# EasyEDA Pro project Complete_project.epro, schematic Schematic3

## Sheets
1 主控: Board Name: core2.0; Create Date: 2025-02-19; Page Name: 主控; Project Name: 煮茶机; Schematic Name: Schematic3; Update Date: 2025-03-25; Company: 嘉立创EDA; Page Size: A4; Version: V1.0
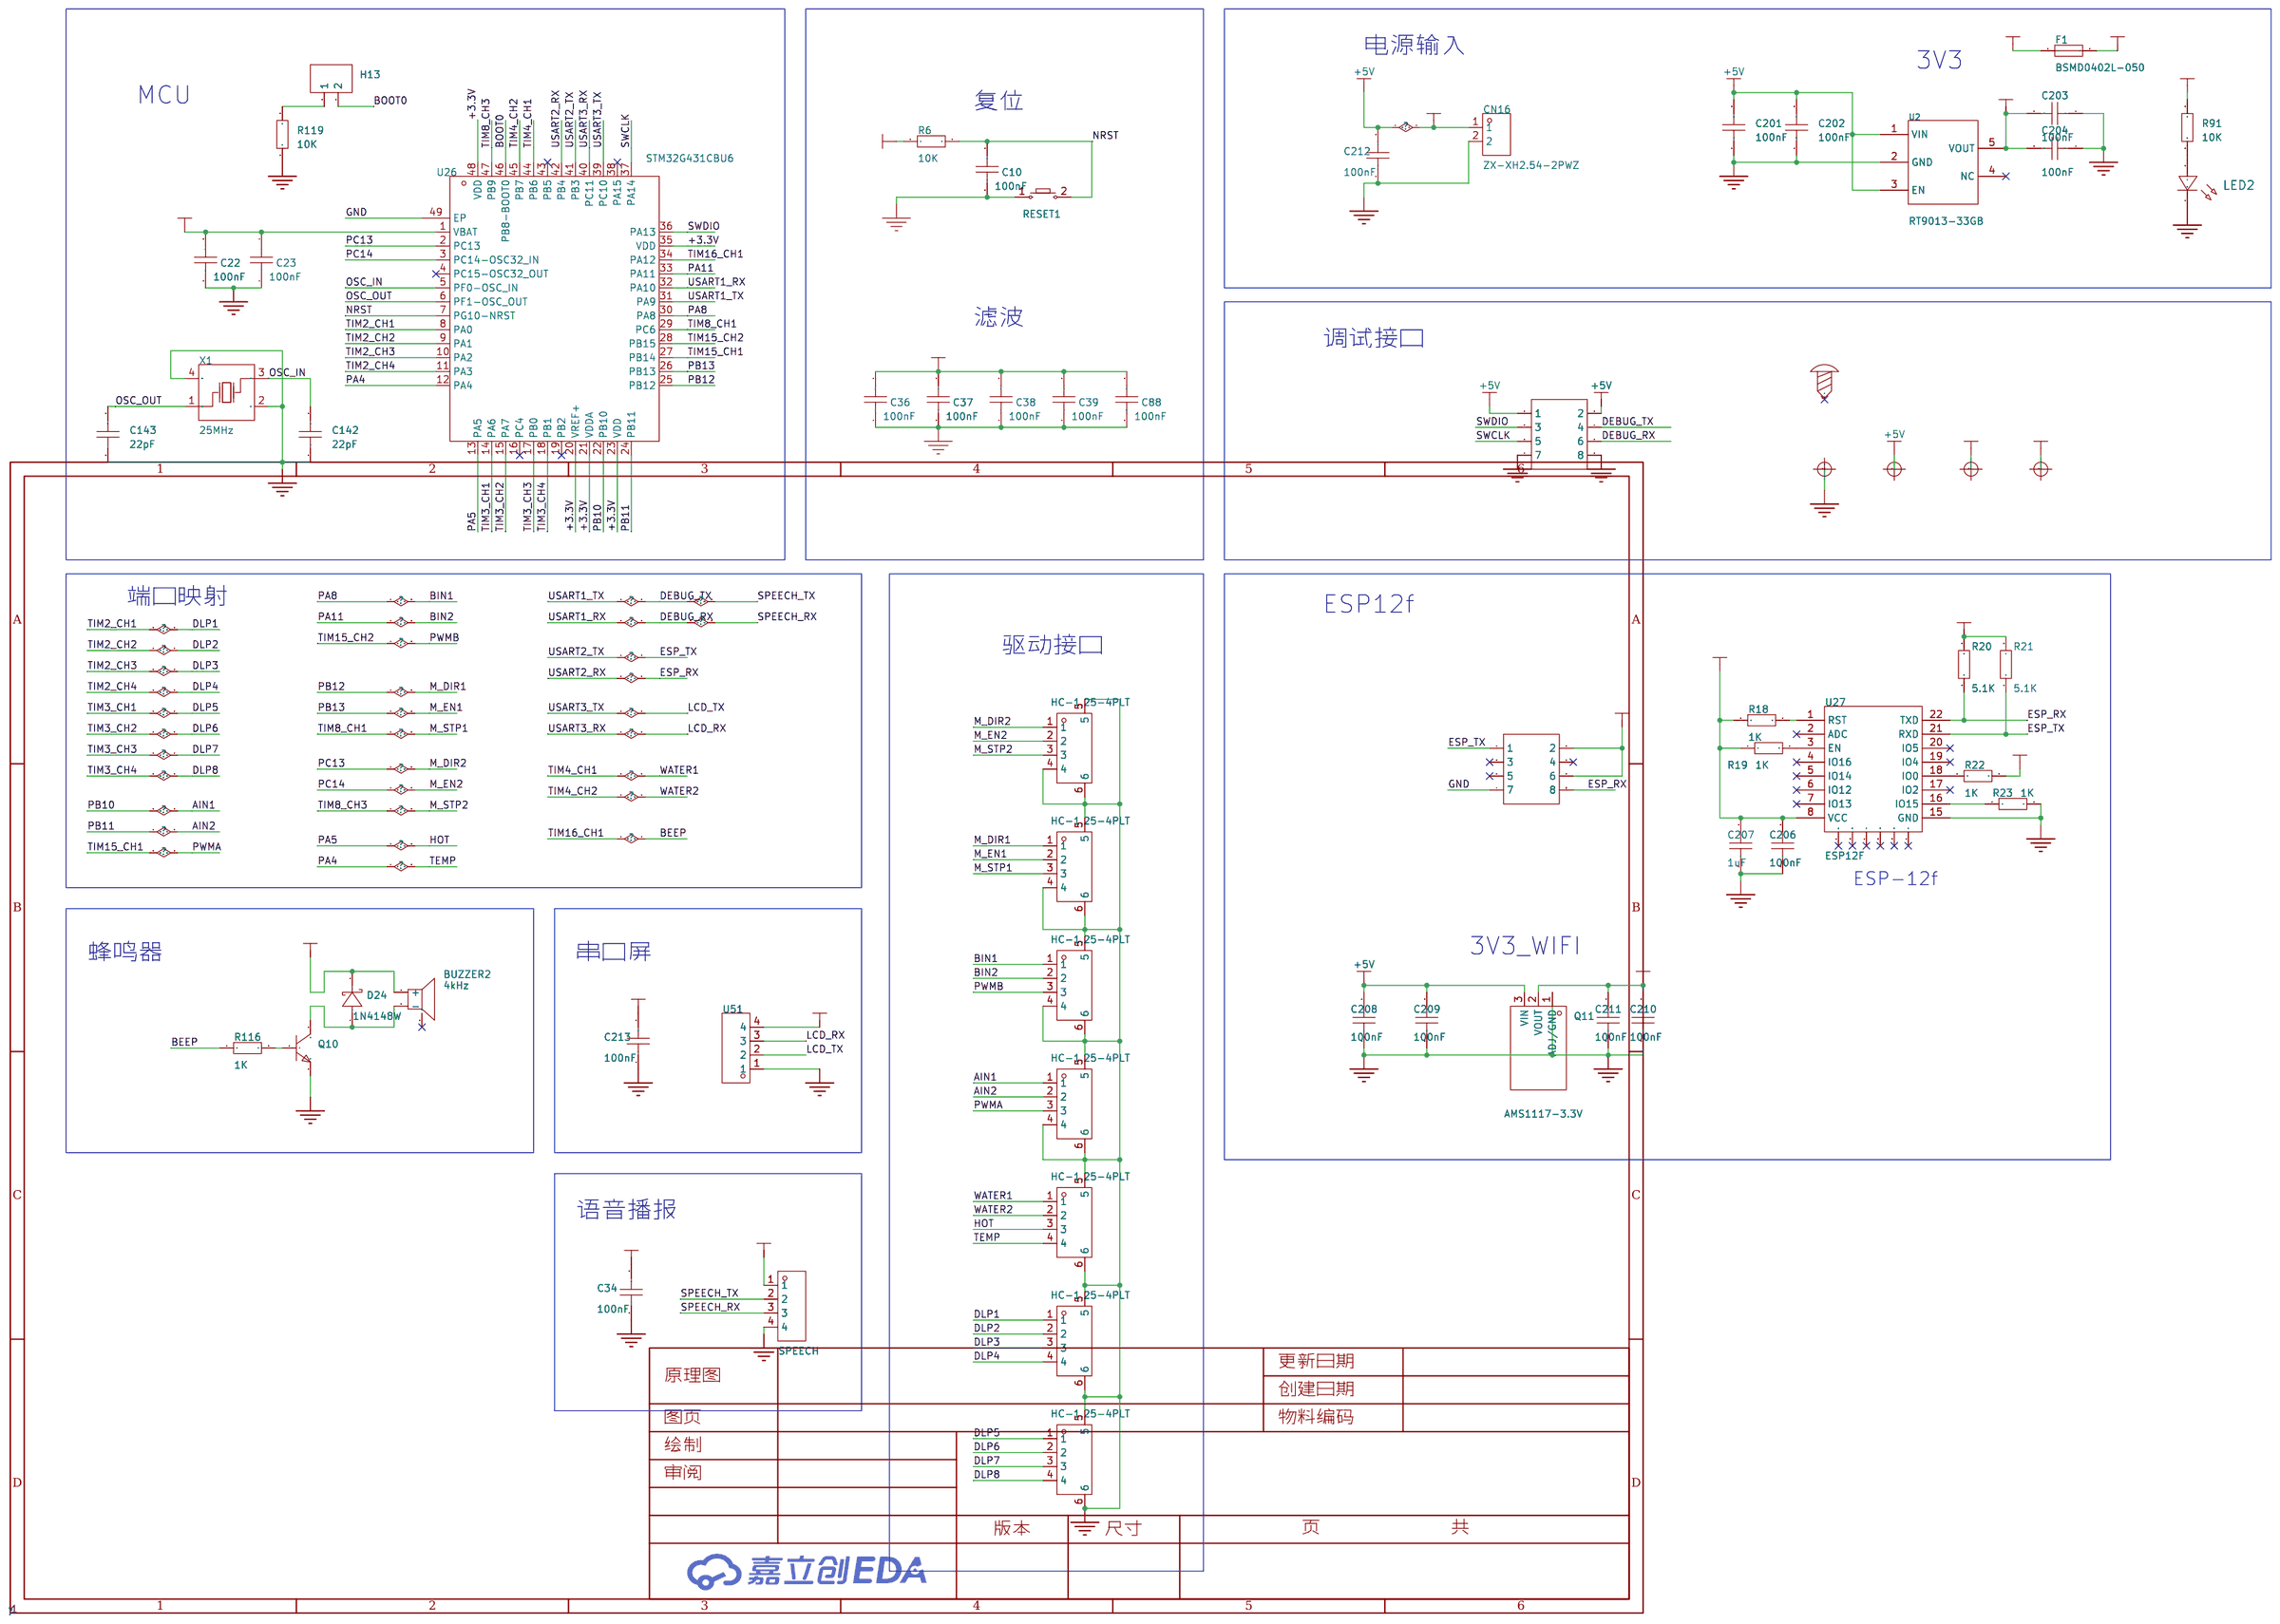
[diagram p9: 主控]
2 POWER TREE: Page Name: POWER TREE; Update Date: 2025-02-22
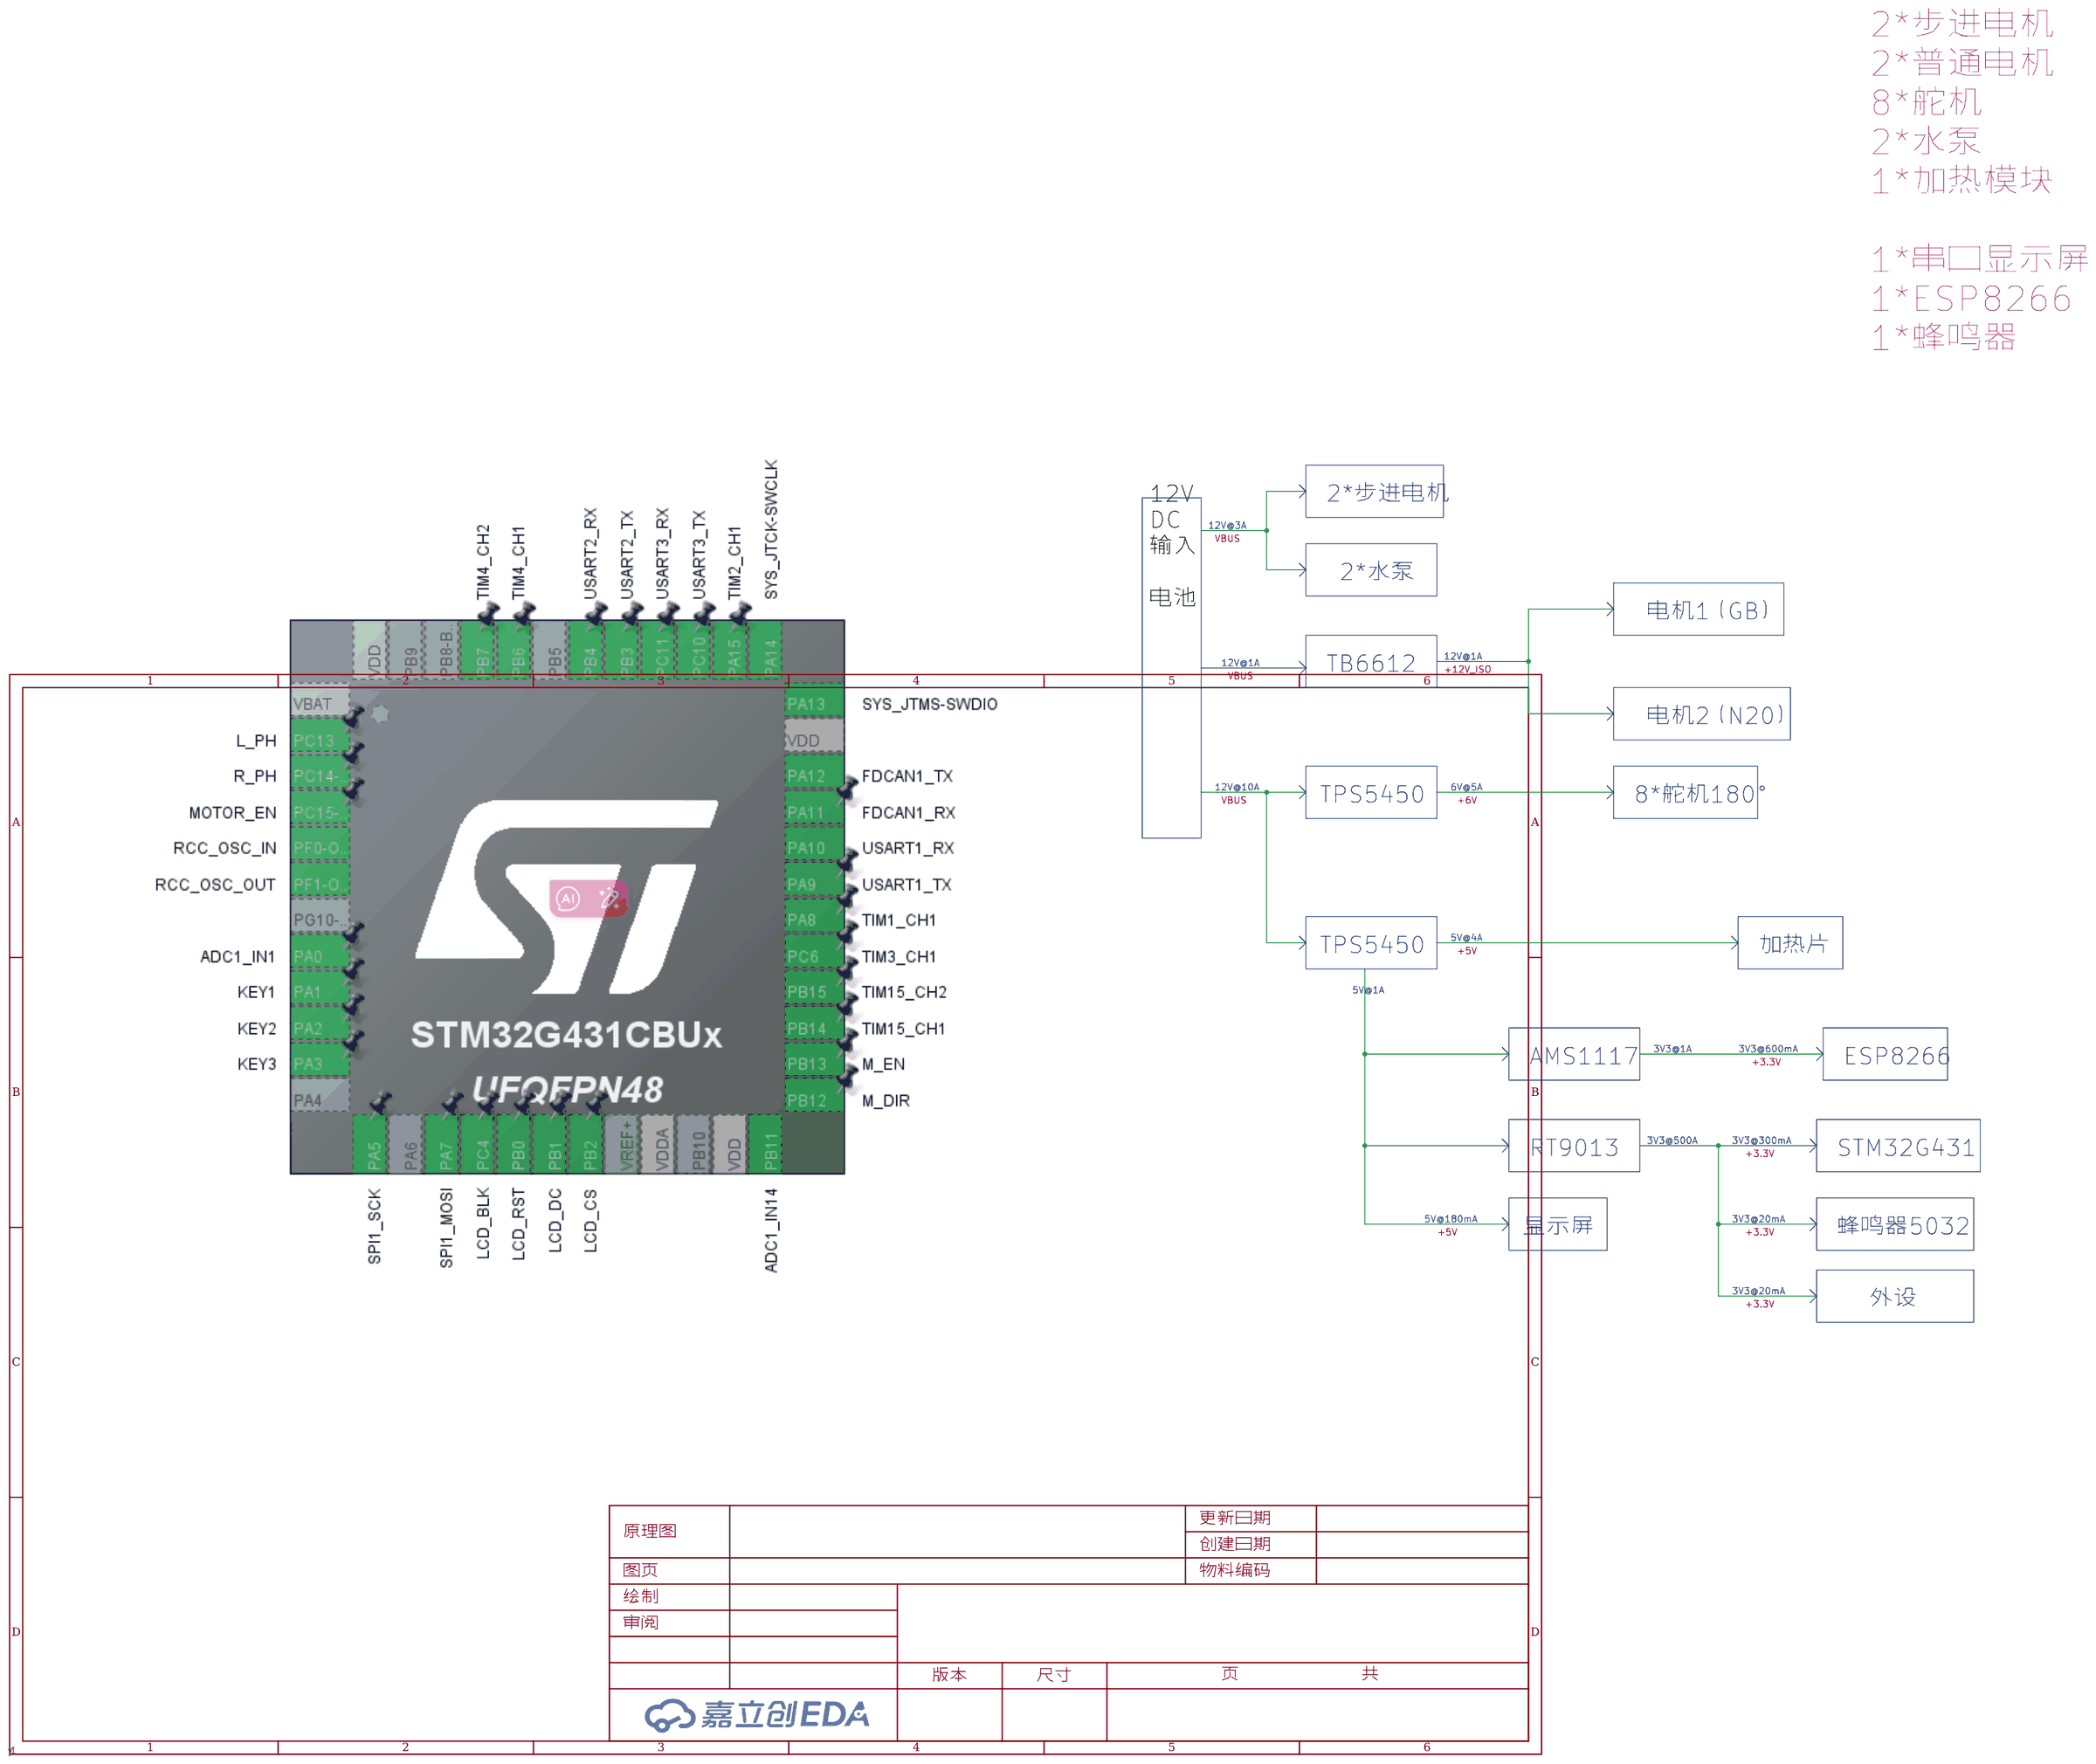
[diagram p10: POWER TREE]

## Parts
BUZZER2  4kHz  [BUZ-SMD_L5.0-W5.5-P4.60]
C10  100nF  [C0805]
C22  100nF  [C0805]
C23  100nF  [C0805]
C34  100nF  [C0805]
C36  100nF  [C0805]
C37  100nF  [C0805]
C38  100nF  [C0805]
C39  100nF  [C0805]
C88  100nF  [C0805]
C142  22pF  [C0805]
C143  22pF  [C0805]
C201  100nF  [C0805]
C202  100nF  [C0805]
C203  100nF  [C0805]
C204  100nF  [C0805]
C206  100nF  [C0805]
C207  1uF  [C0805]
C208  100nF  [C0805]
C209  100nF  [C0805]
C210  100nF  [C0805]
C211  100nF  [C0805]
C212  100nF  [C0805]
C213  100nF  [C0805]
CN2  SPEECH  [CONN-TH_XH2.50-4P]
CN16  ZX-XH2.54-2PWZ  [CONN-TH_2P-P2.50_ZX-XH2.54-2PWZ]
CN111  HC-1.25-4PLT  [CONN-SMD_4P-P1.25_HCTL_HC-1.25-4PLT]
CN112  HC-1.25-4PLT  [CONN-SMD_4P-P1.25_HCTL_HC-1.25-4PLT]
CN113  HC-1.25-4PLT  [CONN-SMD_4P-P1.25_HCTL_HC-1.25-4PLT]
CN114  HC-1.25-4PLT  [CONN-SMD_4P-P1.25_HCTL_HC-1.25-4PLT]
CN115  HC-1.25-4PLT  [CONN-SMD_4P-P1.25_HCTL_HC-1.25-4PLT]
CN116  HC-1.25-4PLT  [CONN-SMD_4P-P1.25_HCTL_HC-1.25-4PLT]
CN117  HC-1.25-4PLT  [CONN-SMD_4P-P1.25_HCTL_HC-1.25-4PLT]
D24  1N4148W  [SOD-123_L2.7-W1.6-LS3.7-FD]
F1  BSMD0402L-050  [F0402]
H4  -  [HDR-TH_8P-P2.54-V-F-R2-C4-S2.54-1]
H9  -  [HDR-TH_8P-P2.54-V-F-R2-C4-S2.54-1]
H13  -  [HDR-TH_2P-P2.54-V-F]
LED2  -  [LED_0805]
MARK1  -  [Mark-Point-1mm]  (no BOM)
MARK2  -  [Mark-Point-1mm]  (no BOM)
MARK3  -  [Mark-Point-1mm]  (no BOM)
MARK4  -  [Mark-Point-1mm]  (no BOM)
Q10  -  [S8050_SOT-23]
Q11  AMS1117-3.3V  [SOT-89-3_L4.5-W2.5-P1.50-LS4.2-BR]
R6  10K  [R0805]
R18  1K  [R0805]
R19  1K  [R0805]
R20  5.1K  [R0805]
R21  5.1K  [R0805]
R22  1K  [R0805]
R23  1K  [R0805]
R91  10K  [R0805]
R116  1K  [R0805]
R119  10K  [R0805]
RESET1  -  [SW_PB2_A1]
SCREW1  -  [M2螺丝]
U2  RT9013-33GB  [SOT-23-5_L3.0-W1.7-P0.95-LS2.8-BL]
U26  STM32G431CBU6  [UFQFPN-48_L7.0-W7.0-P0.50-BL-EP]
U27  ESP12F  [ESP12F]
U51  ZX-XH2.54-4PWZ-Y  [CONN-TH_4P-P2.50_ZX-XH2.54-4PWZ-Y]
X1  25MHz  [CRYSTAL-SMD_4P-L3.2-W2.5-BL]

## Library data of the parts
BUZZER2 = MLT-5020: 驱动方式:无源(外部驱动);构造类型:电磁式;频率:4kHz;; Supplier Part: C94598; Manufacturer: 华能; Supplier Footprint: SMD,5x5mm; JLCPCB Part Class: 扩展库; Datasheet: https://atta.szlcsc.com/upload/public/pdf/source/20210811/111454390007D221D7259018FB170E62.pdf; Supplier: LCSC; Oscillator Circuit: 无源(外部驱动); Technology Type: 电磁式; Length: 5.2mm; Width: 5.2mm; Height: 2.5mm
C10 C22 C23 C34 C36-C39 C88 C142 C143 C201-C204 C206-C213 = CAP_0805: Supplier Footprint: 0805
CN2 = XH-4A_C2908602: 参考系列:XH;间距:2.5mm;插针结构:1x4P;排数:1;每排PIN数:4;行距:-;公母:公型插针;安装方式:直插;额定电流:3A;工作温度范围:-25℃~+85℃;; LCSC Part Name: XH 2.5mm 1x4P 直插; Supplier Part: C2908602; Manufacturer: HCTL(华灿天禄); Manufacturer Part: XH-4A; Supplier Footprint: 插件,P=2.5mm; JLCPCB Part Class: Extended Part; Datasheet: https://atta.szlcsc.com/upload/public/pdf/source/20211021/653319DEFF6FA72D109D92786067BD8A.pdf; Supplier: LCSC; Reference Series: XH; Pitch: 2.5mm; Pins Structure: 1x4P; Number of Rows: 1; Number of PINs Per Row: 4; Gender: 公型插针; Mounting Style: 直插; Current Rating (Max): 3A; Operating Temperature Range: -25℃~+85℃
CN16 = ZX-XH2.54-2PWZ: 插针结构:1x2P;间距:2.54mm;安装方式:弯插;参考系列:XH;总PIN数:2P;排数:1;每排PIN数:2;行距:-;额定电流:3A;触头材质:黄铜;触头镀层:锡;工作温度范围:-25℃~+85℃;; Supplier Part: C7429641; Manufacturer: Megastar(兆星); Supplier Footprint: 弯插,P=2.54mm; JLCPCB Part Class: 扩展库; Datasheet: https://atta.szlcsc.com/upload/public/pdf/source/20230619/56AE8F2E01CDFEAA97FC89B5ED558AB5.pdf; Supplier: LCSC; Pins Structure: 1x2P; Pitch: 2.54mm; Mounting Style: 弯插; Reference Series: XH; Number of Pins: 2P; Number of Rows: 1; Number of PINs Per Row: 2; Current Rating (Max): 3A; Contact Material: 黄铜; Contact Plating: 锡; Operating Temperature Range: -25℃~+85℃
CN111-CN117 = HC-1.25-4PLT: 插针结构:1x4P;间距:1.25mm;安装方式:立贴;参考系列:-;总PIN数:4P;排数:1;每排PIN数:4;行距:-;额定电流:2A;触头材质:黄铜;触头镀层:锡;工作温度范围:-25℃~+85℃;; LCSC Part Name: 1x4P 间距:1.25mm 立贴; Supplier Part: C2845390; Manufacturer: HCTL(华灿天禄); Supplier Footprint: SMD,P=1.25mm; JLCPCB Part Class: 扩展库; Datasheet: https://atta.szlcsc.com/upload/public/pdf/source/20230707/8E5913B5A3195C18F5EE12EA4CB86B82.pdf; Supplier: LCSC; Pins Structure: 1x4P; Pitch: 1.25mm; Mounting Style: 立贴; Number of Pins: 4P; Number of Rows: 1; Number of PINs Per Row: 4; Current Rating (Max): 2A; Contact Material: 黄铜; Contact Plating: 锡; Operating Temperature Range: -25℃~+85℃
D24 = 1N4148W_C7420318: 二极管配置:独立式;正向压降(Vf):1.25V@150mA;直流反向耐压(Vr):100V;平均整流电流(Io):150mA;功率:400mW;反向恢复时间(trr):4ns;; LCSC Part Name: 电压:100V 电流:150mA; Supplier Part: C7420318; Manufacturer: 宏迦橙; Supplier Footprint: SOD-123; JLCPCB Part Class: 扩展库; Datasheet: https://atta.szlcsc.com/upload/public/pdf/source/20230828/E5C3F7A4272052930A7E03B75759BF50.pdf; Supplier: LCSC; Diode Configuration: 独立式; Forward Voltage (Vf@If): 1.25V@150mA; Reverse Voltage (Vr): 100V; Average Rectified Current (Io): 150mA; Power Dissipation: 400mW; Reverse Leakage Current: 1uA@75V; Reverse Recovery Time (trr): 4ns; Operating Temperature: -55℃~+150℃
F1 = BSMD0402L-050: 最大电压:6V;最大电流:40A;保持电流:500mA;跳闸电流:1A;; LCSC Part Name: 6V 500mA 0402自恢复; Supplier Part: C914087; Manufacturer: BHFUSE(佰宏); Supplier Footprint: 0402; JLCPCB Part Class: 扩展库; Datasheet: https://atta.szlcsc.com/upload/public/pdf/source/20230512/81993D19BE7C594631D65321B72A7525.pdf; Supplier: LCSC; Operating Voltage (Max): 6V; Current Rating (Max): 40A; Hold Current: 500mA; Trip Current: 1A; Power Dissipation: 500mW; Resistance - Initial (Ri) (Min): 40mΩ; Resistance - Post Trip (R1) (Max): 400mΩ; Maximum Time to Trip: 100ms; Operating Temperature: -40℃~+85℃
H4 H9 = HDR-F_2.54_2x4: Supplier Part: C92271; Supplier Footprint: 插件
H13 = HDR-F_2.54_1x2P: Supplier Part: C49661; Supplier Footprint: 插件
LED2 = LED_0805-R: Supplier Footprint: 0805
MARK1-MARK4 = Mark-Point: Mark点
Q10 = S8050_SOT_NPN: Supplier Footprint: SOT-23
Q11 = AMS1117-3.3V_C5120796: 输出类型:固定;最大输入电压:18V;输出电压:3.3V;最大输出电流:1A;输出极性:正极;; LCSC Part Name: 输入18V 输出3.3V 1A; Supplier Part: C5120796; Manufacturer: MSKSEMI(美森科); Supplier Footprint: SOT-89; JLCPCB Part Class: 扩展库; Datasheet: https://atta.szlcsc.com/upload/public/pdf/source/20220727/5E62EAC46FFFF83337622C0FBE1B6BF8.pdf; Supplier: LCSC; Output Type: 固定; Maximum Input Voltage: 18V; Output Voltage: 3.3V; MAX Output Current: 1A; Dropout Voltage: 1.4V@(1A); standby current: 12mA; Operating Temperature: 0℃~+125℃; Output Polarity: 正极; Number of Outputs: 1
R6 R91 R116 R119 = Res_0805: Supplier Footprint: 0805
R18-R23 = Res_0603: Supplier Footprint: 0603
RESET1 = Key_SMD_3x4x2: Supplier Footprint: SMD
SCREW1 = M2螺丝: Supplier Footprint: 插件
U2 = RT9013-33GB: 输出类型:固定;输出极性:正;最大输入电压:5.5V;输出电压:3.3V;输出电流:500mA;电源纹波抑制比(PSRR):50dB@(10kHz);; LCSC Part Name: 输入5.5V 输出3.3V 500mA; Supplier Part: C47773; Manufacturer: RICHTEK(立锜); Supplier Footprint: SOT-23-5; JLCPCB Part Class: 扩展库; Datasheet: https://atta.szlcsc.com/upload/public/pdf/source/20150504/1457707282459.pdf; Supplier: LCSC; Output Type: 固定; Output Polarity: 正; Number of Outputs: 1; Maximum Input Voltage: 5.5V; Output Voltage: 3.3V; Dropout Voltage: 400mV@(500mA); Quiescent Current (Ground Current): 50uA; Output Current: 500mA; Power Supply Rejection Ratio (PSRR): 50dB@(10kHz); Operating Temperature: -40℃~+85℃
U26 = STM32G431CBU6: CPU内核:ARM-M系列;程序存储容量:128KB;RAM总容量:32KB;GPIO端口数量:42;工作电压范围:1.71V~3.6V;CPU最大主频:170MHz;程序存储器类型:FLASH;; Supplier Part: C529356; Manufacturer: ST(意法半导体); Supplier Footprint: UFQFPN-48(7x7); JLCPCB Part Class: 扩展库; Datasheet: https://atta.szlcsc.com/upload/public/pdf/source/20200511/C529354_7C66CF00837B904D0C15DCE45B69418C.pdf; Supplier: LCSC; CPU Core: ARM-M系列; Program Storage Size: 128KB; RAM Size: 32KB; GPIO Ports Number: 42; Operating Voltage Range: 1.71V~3.6V; CPU Maximum Speed: 170MHz; Program Memory Type: FLASH; Operating Temperature Range: -40℃~+85℃; ADC (Bit): 12bit; DAC (Bit): 12bit; Peripheral/Function: DMA；PWM; Watchdog: 有; Infrared Data Association: 有; Low-Voltage Detect: 有; Direct Memory Access: 有; Internal Oscillator: 有
U27 = ESP12F: _: 3
U51 = ZX-XH2.54-4PWZ-Y: 插针结构:1x4P;间距:2.54mm;安装方式:弯插;参考系列:XH;总PIN数:4P;排数:1;每排PIN数:4;触头材质:铜合金;触头镀层:锡;工作温度范围:-25℃~+85℃;; LCSC Part Name: 1x4P 间距:2.54mm 弯插 系列:XH; Supplier Part: C22388631; Manufacturer: Megastar(兆星); Supplier Footprint: 弯插,P=2.54mm; JLCPCB Part Class: 扩展库; Datasheet: https://atta.szlcsc.com/upload/public/pdf/source/20240429/5637F708FFDFB25A638AA785AB789433.pdf; Supplier: LCSC; Pins Structure: 1x4P; Pitch: 2.54mm; Mounting Style: 弯插; Reference Series: XH; Number of Pins: 4P; Number of Rows: 1; Number of PINs Per Row: 4; Contact Material: 铜合金; Contact Plating: 锡; Operating Temperature Range: -25℃~+85℃; Rated Voltage (Max): 250V; Plastic Material: PA66; Colour: 黄色
X1 = X322525MOB4SI: 晶振类型:贴片晶振;频率:25MHz;常温频差:±10ppm;负载电容:12pF;频率稳定度(全温):±20ppm;; LCSC Part Name: 25MHz ±10ppm 12pF; Supplier Part: C9006; Manufacturer: YXC(扬兴晶振); Supplier Footprint: SMD3225-4P; JLCPCB Part Class: Basic Part; Datasheet: https://atta.szlcsc.com/upload/public/pdf/source/20240329/19D5F850207469550BEB00D7DFEDBC7A.pdf; Supplier: LCSC; Crystal Type: 贴片晶振; Normal temperature Frequency Tolerance: ±10ppm; Load Capacitor: 12pF; Frequency Stability(Full temperature range): ±20ppm; Operating Temperature: -40℃~+85℃

## Nets
+3.3V: BUZZER2.1(+) C22.2 C23.2 C36.2 C37.2 C38.2 C39.2 C88.2 D24.2(K) F1.2 MARK3.1 R6.2 U26.1(VBAT) U26.20(VREF+) U26.21(VDDA) U26.23(VDD) U26.35(VDD) U26.48(VDD)
+3.3V_WIFI: C206.2 C207.2 C210.2 C211.2 H9.2 H9.6 MARK4.1 Q11.2(VOUT) R18.1 R19.1 R20.2 R21.2 R22.2 U27.8(VCC)
+3.3VCC: C203.2 C204.2 F1.1 R91.2 U2.5(VOUT)
+5V: C34.2 C201.2 C202.2 C208.2 C209.2 C212.2 C213.2 CN2.1 CN16.1 H4.1 H4.2 MARK2.1 Q11.3(VIN) U2.1(VIN) U2.3(EN) U51.4
GND: C10.2 C22.1 C23.1 C34.1 C36.1 C37.1 C38.1 C39.1 C88.1 C142.1 C143.1 C201.1 C202.1 C203.1 C204.1 C206.1 C207.1 C208.1 C209.1 C210.1 C211.1 C212.1 C213.1 CN2.4 CN16.2 CN111.5 CN111.6 CN112.5 CN112.6 CN113.5 CN113.6 CN114.4 CN114.5 CN114.6 CN115.4 CN115.5 CN115.6 CN116.4 CN116.5 CN116.6 CN117.4 CN117.5 CN117.6 H4.7 H4.8 H9.7 LED2.1(C) MARK1.1 Q10.2 Q11.1(ADJ/GND) R23.2 R119.1 RESET1.1 U2.2(GND) U26.49(EP) U27.15(GND) U51.1 X1.2(GND) X1.4(GND)
AIN1: CN114.1 U26.22(PB10)
AIN2: CN114.2 U26.24(PB11)
BEEP: R116.1 U26.34(PA12)
BIN1: CN115.1 U26.30(PA8)
BIN2: CN115.2 U26.33(PA11)
BOOT0: H13.2 U26.46(PB8-BOOT0)
DEBUG_RX: CN2.3 H4.6 U26.32(PA10)
DEBUG_TX: CN2.2 H4.4 U26.31(PA9)
DLP1: CN111.1 U26.8(PA0)
DLP2: CN111.2 U26.9(PA1)
DLP3: CN111.3 U26.10(PA2)
DLP4: CN111.4 U26.11(PA3)
DLP5: CN112.1 U26.14(PA6)
DLP6: CN112.2 U26.15(PA7)
DLP7: CN112.3 U26.17(PB0)
DLP8: CN112.4 U26.18(PB1)
ESP_RX: H9.8 R20.1 U26.42(PB4) U27.22(TXD)
ESP_TX: H9.1 R21.1 U26.41(PB3) U27.21(RXD)
HOT: CN113.3 U26.13(PA5)
LCD_RX: U26.40(PC11) U51.3
LCD_TX: U26.39(PC10) U51.2
M_DIR1: CN116.1 U26.25(PB12)
M_DIR2: CN117.1 U26.2(PC13)
M_EN1: CN116.2 U26.26(PB13)
M_EN2: CN117.2 U26.3(PC14-OSC32_IN)
M_STP1: CN116.3 U26.29(PC6)
M_STP2: CN117.3 U26.47(PB9)
NRST: C10.1 R6.1 RESET1.2 U26.7(PG10-NRST)
OSC_IN: C142.2 U26.5(PF0-OSC_IN) X1.3(OSC2)
OSC_OUT: C143.2 U26.6(PF1-OSC_OUT) X1.1(OSC1)
PA4: CN113.4 U26.12(PA4)
PWMA: CN114.3 U26.27(PB14)
PWMB: CN115.3 U26.28(PB15)
SWCLK: H4.5 U26.37(PA14)
SWDIO: H4.3 U26.36(PA13)
TIM4_CH1: CN113.1 U26.44(PB6)
TIM4_CH2: CN113.2 U26.45(PB7)
$1N6811: LED2.2(A) R91.1
$1N6895: R23.1 U27.16(IO15)
$1N6897: R19.2 U27.3(EN)
$1N6898: R22.1 U27.18(IO0)
$1N6899: R18.2 U27.1(RST)
$1N6951: BUZZER2.2(-) D24.1(A) Q10.3
$1N7114: Q10.1 R116.2
$1N9890: H13.1 R119.2

Not connected (* = marked no-connect by the designer): BUZZER2 3(NC)*; H9 3* 4* 5*; SCREW1 1*; U2 4(NC)*; U26 4(PC15-OSC32_OUT)* 16(PC4)* 19(PB2)* 38(PA15)* 43(PB5)*; U27 2(ADC)* 4(IO16)* 5(IO14)* 6(IO12)* 7(IO13)* 9* 10* 11* 12* 13* 14* 17(IO2)* 19(IO4)* 20(IO5)*

## Notes on the sheets
sheet 1
- 电源输入
- 3V3
- MCU
- 复位
- 滤波
- 调试接口
- 端口映射
- ESP12f
- 驱动接口
- ESP-12f
- 蜂鸣器
- 串口屏
- 3V3_WIFI
- 语音播报
sheet 2
- 2*步进电机
  2*普通电机
  8*舵机
  2*水泵
  1*加热模块
  1*串口显示屏
  1*ESP8266
  1*蜂鸣器
- 2*步进电机
- 12V@3A
- VBUS
- 2*水泵
- 12V
  DC
  输入
  电池
- 电机1（GB）
- 12V@1A
- 12V@1A
- TB6612
- +12V_ISO
- VBUS
- 电机2（N20）
- 12V@10A
- 6V@5A
- VBUS
- TPS5450
- +6V
- 8*舵机180°
- TPS5450
- 5V@4A
- +5V
- 加热片
- 5V@1A
- 3V3@1A
- 3V3@600mA
- AMS1117
- +3.3V
- ESP8266
- 3V3@500A
- 3V3@300mA
- RT9013
- +3.3V
- STM32G431
- 5V@180mA
- 3V3@20mA
- +5V
- 显示屏
- +3.3V
- 蜂鸣器5032
- 3V3@20mA
- +3.3V
- 外设
